# EAGLE design robot (EAGLE 7.0.0)
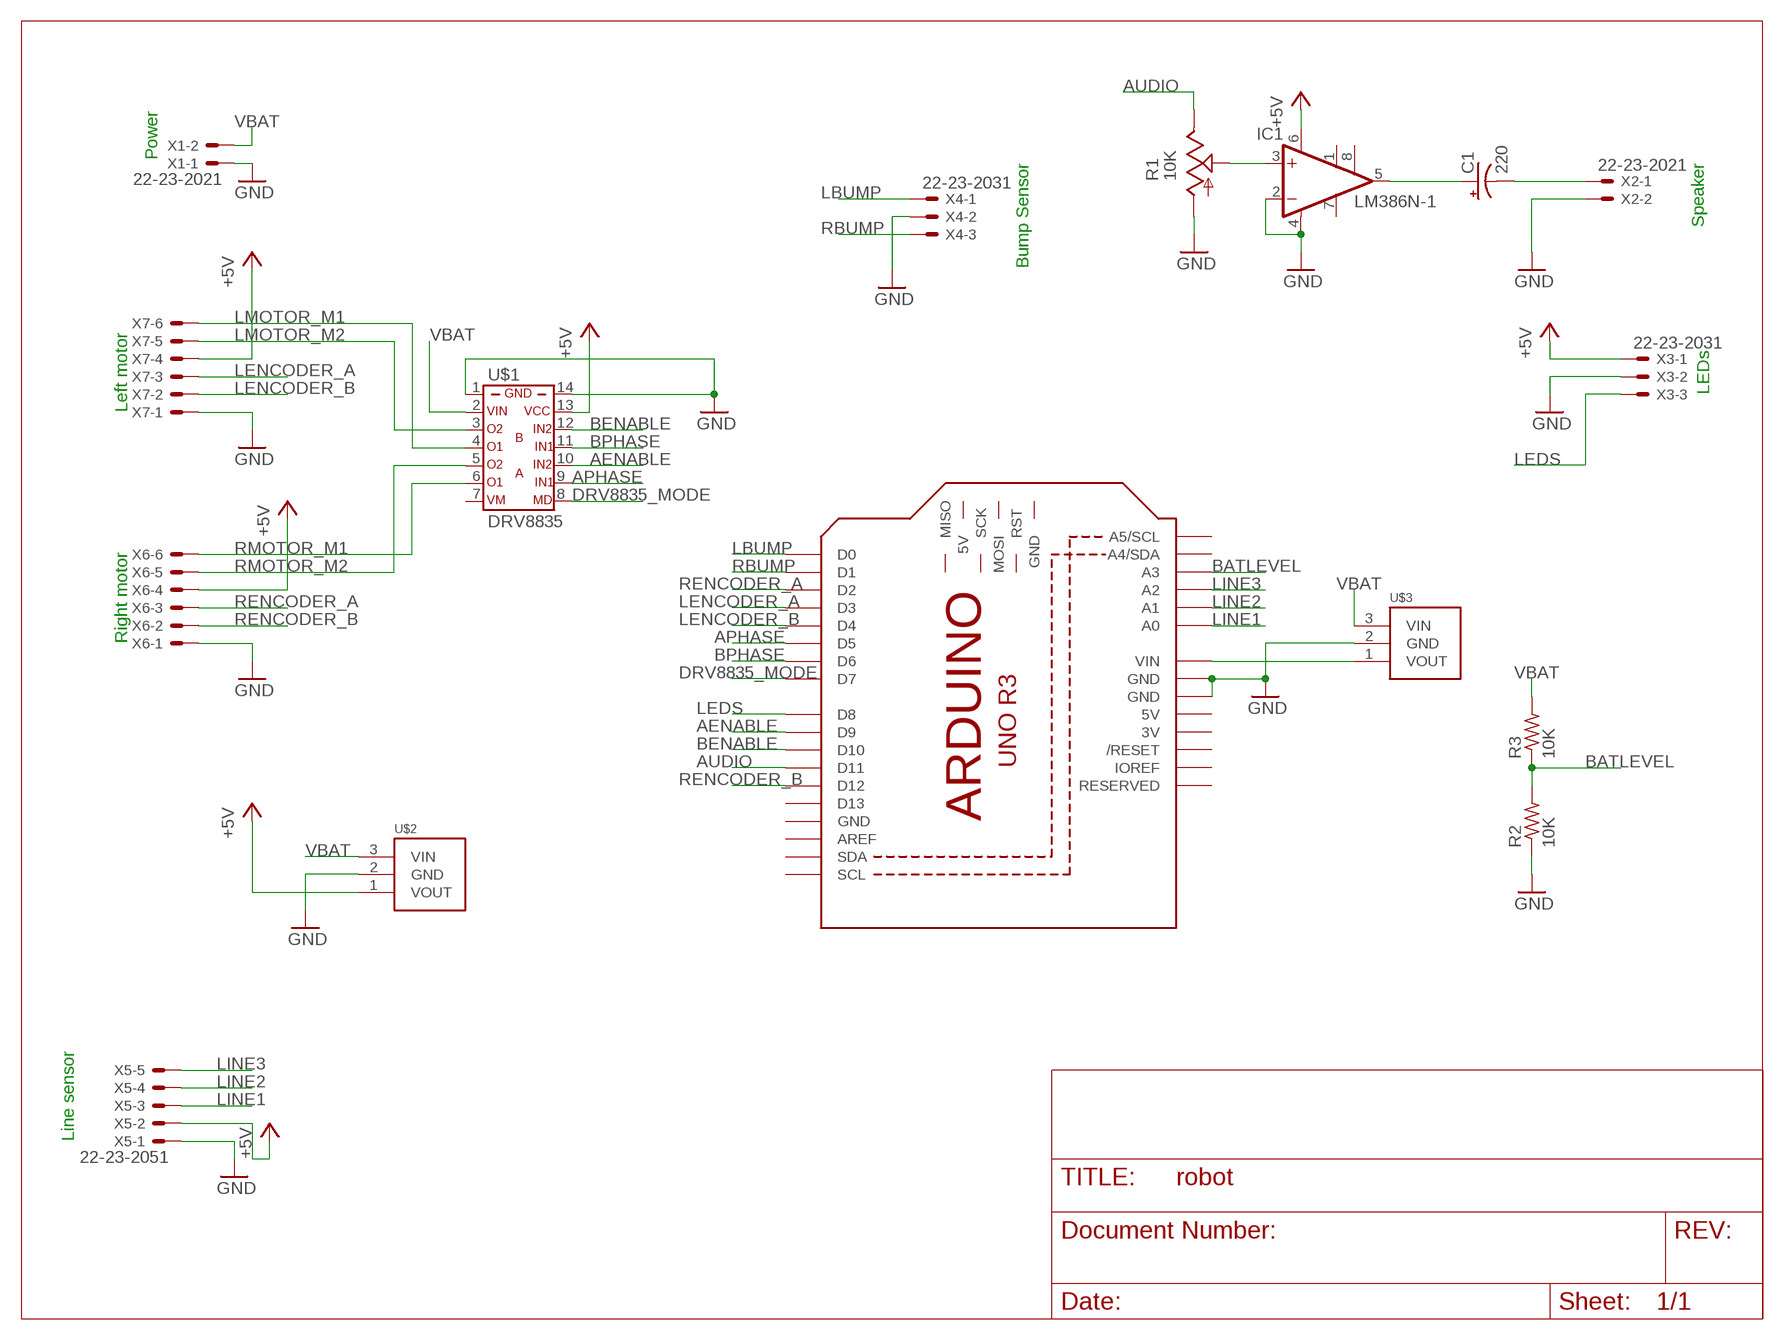
[diagram p0: schematic, sheet 1]

## Parts
C1  220  CPOL-USE2.5-7  [E2,5-7]
IC1  LM386N-1  [DIL08]
M2  ARDUINO_R3_ICSP  [ARDUINOR3_ICSP]
R1  10K  TRIM_US-S64W  [S64W]
R2  10K  R-US_V234/12  [V234/12]
R3  10K  R-US_V234/12  [V234/12]
U$1  DRV8835  [DIL14]
U$2  S7V7F5  [POLOLU-REG]
U$3  U3V12F9  [POLOLU-REG]
X1  22-23-2021  [22-23-2021]
X2  22-23-2021  [22-23-2021]
X3  22-23-2031  [22-23-2031]
X4  22-23-2031  [22-23-2031]
X5  22-23-2051  [22-23-2051]
X6  22-23-2061  [22-23-2061]
X7  22-23-2061  [22-23-2061]

## Nets
+5V [VCC]: IC1.6(VS) U$1.13 U$2.1(VOUT) X3.1 X5.2 X6.4 X7.4
AENABLE: M2.D9 U$1.10
APHASE: M2.D5 U$1.9
AUDIO: M2.D11 R1.E
BATLEVEL: M2.A3 R2.2 R3.1
BENABLE: M2.D10 U$1.12
BPHASE: M2.D6 U$1.11
DRV8835_MODE: M2.D7 U$1.8
GND [GND]: IC1.2(-IN) IC1.4(GND) M2.GND@1(GND) M2.GND@3(GND) R1.A R2.1 U$1.1 U$1.14 U$2.2(GND) U$3.2(GND) X1.1 X2.2 X3.2 X4.2 X5.1 X6.1 X7.1
LBUMP: M2.D0 X4.1
LEDS: M2.D8 X3.3
LENCODER_A: M2.D3 X7.3
LENCODER_B: M2.D4 X7.2
LINE1: M2.A0 X5.3
LINE2: M2.A1 X5.4
LINE3: M2.A2 X5.5
LMOTOR_M1 [MOTOR]: U$1.4 X7.6
LMOTOR_M2 [MOTOR]: U$1.3 X7.5
N$5 [VCC]: M2.VIN U$3.1(VOUT)
N$6: C1.+ IC1.5(OUT)
N$7: IC1.3(+IN) R1.S
N$8: C1.- X2.1
RBUMP: M2.D1 X4.3
RENCODER_A: M2.D2 X6.3
RENCODER_B: M2.D12 X6.2
RMOTOR_M1 [MOTOR]: U$1.6 X6.6
RMOTOR_M2 [MOTOR]: U$1.5 X6.5
VBAT [VBAT]: R3.2 U$1.2 U$2.3(VIN) U$3.3(VIN) X1.2
Unconnected: IC1.1(GAIN) IC1.7(BYPASS) IC1.8(GAIN) M2.5V_ICSP(5V) M2.A4(A4/SDA) M2.A5(A5/SCL) M2.AREF M2.D13 M2.GND@2(GND) M2.IOREF M2.MISO M2.MOSI M2.RESERVED M2.RESET(/RESET) M2.RESET_ICSP(RST) M2.SCK M2.SCL M2.SDA U$1.7

## Notes on the sheet
- Power | Bump Sensor | Speaker
- LEDs
- Left motor
- Right motor
- Line sensor

## Power pins joined to a net without a drawn wire
3V: M2.3V
5V: M2.5V
GND: M2.GND

## Library data of the parts
C1 = adafruit:CPOL-US: POLARIZED CAPACITOR, American symbol
IC1 = linear:LM386?-*: Low Voltage Audio Power Amplifier Source: http://cache.national.com/ds/LM/LM386.pdf
M2 = adafruit:ARDUINO_R3_ICSP
R1 = pot:TRIM_US-: POTENTIOMETER
R2 R3 = adafruit:R-US_: RESISTOR, American symbol
U$1 = robot:DRV8835: Pololu DRV8835 Dual Motor Driver Carrier
U$2 = robot:S7V7F5: Pololu Regulator
U$3 = robot:U3V12F9: Pololu 9V Step-Up Voltage Regulator U3V12F9
X1 X2 = con-molex:22-23-2021: .100" (2.54mm) Center Header - 2 Pin; MF: MOLEX; MPN: 22-23-2021; OC_FARNELL: 1462926; OC_NEWARK: 25C3832
X3 X4 = con-molex:22-23-2031: .100" (2.54mm) Center Header - 3 Pin; MF: MOLEX; MPN: 22-23-2031; OC_FARNELL: 1462950; OC_NEWARK: 30C0862
X5 = con-molex:22-23-2051: .100" (2.54mm) Center Header - 5 Pin; MF: MOLEX; MPN: 22-23-2051; OC_FARNELL: 1462952; OC_NEWARK: 38C9178
X6 X7 = con-molex:22-23-2061: .100" (2.54mm) Center Header - 6 Pin; MF: MOLEX; MPN: 22-23-2061; OC_FARNELL: 1462922; OC_NEWARK: 27C1933

## Net classes
0 default: width 0.203 mm
1 VCC: width 0.305 mm, drill 0.406 mm
2 VBAT: width 0.305 mm, drill 0.406 mm
3 GND: width 0.254 mm, drill 0.406 mm
4 MOTOR: width 0.305 mm, drill 0.406 mm

## Board
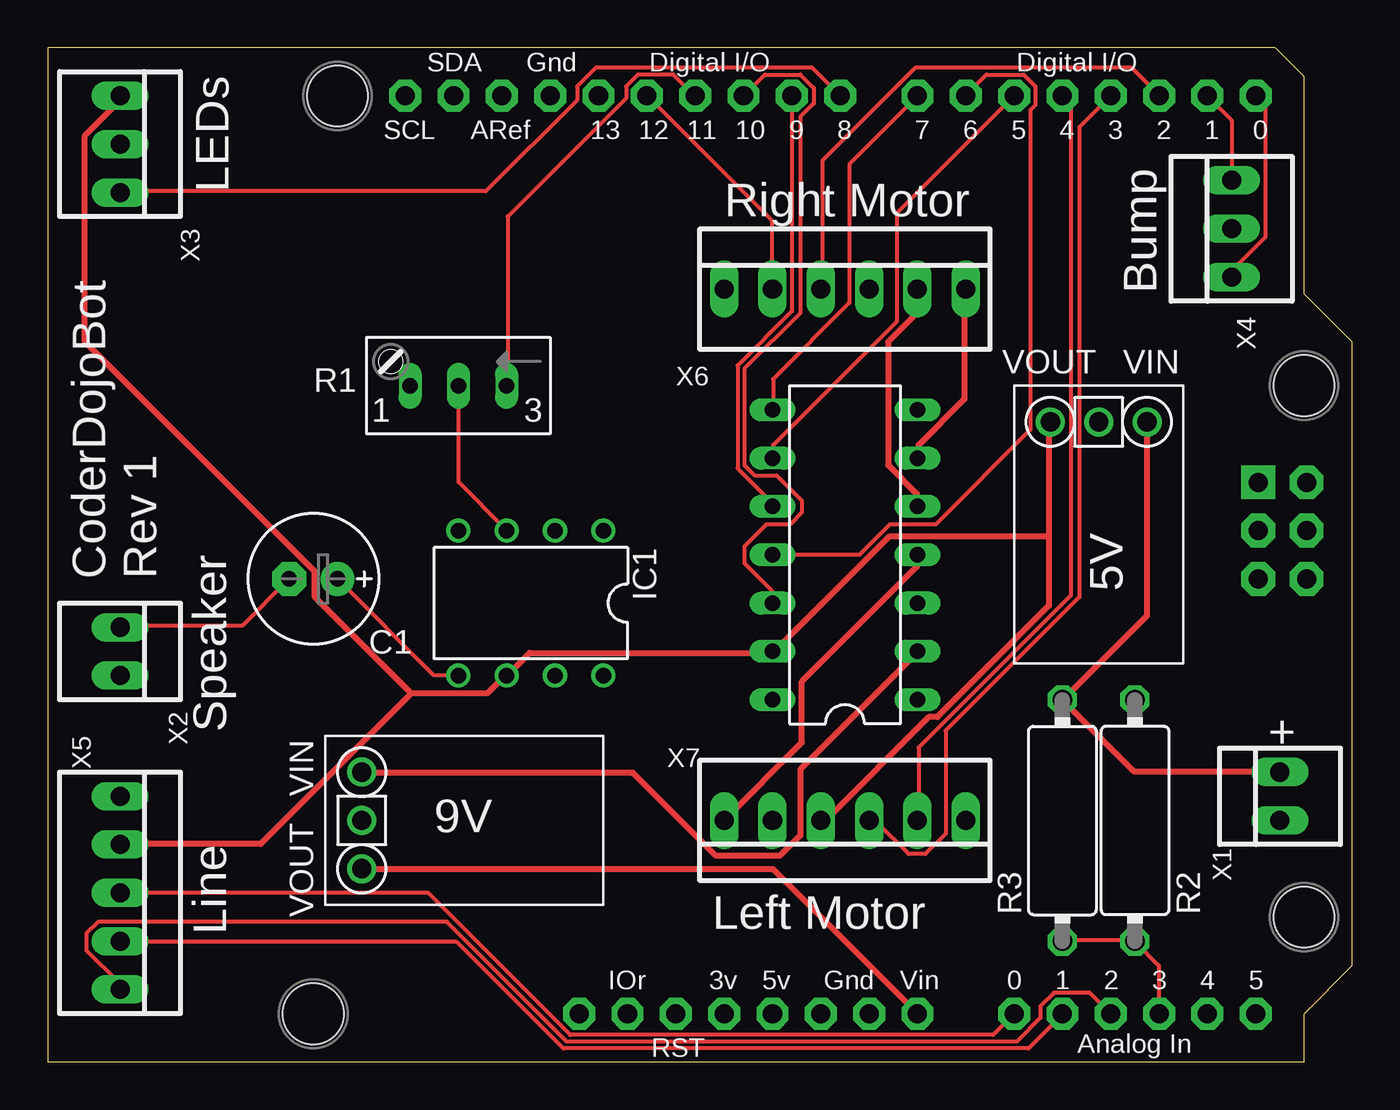
[diagram p1: board, top side]
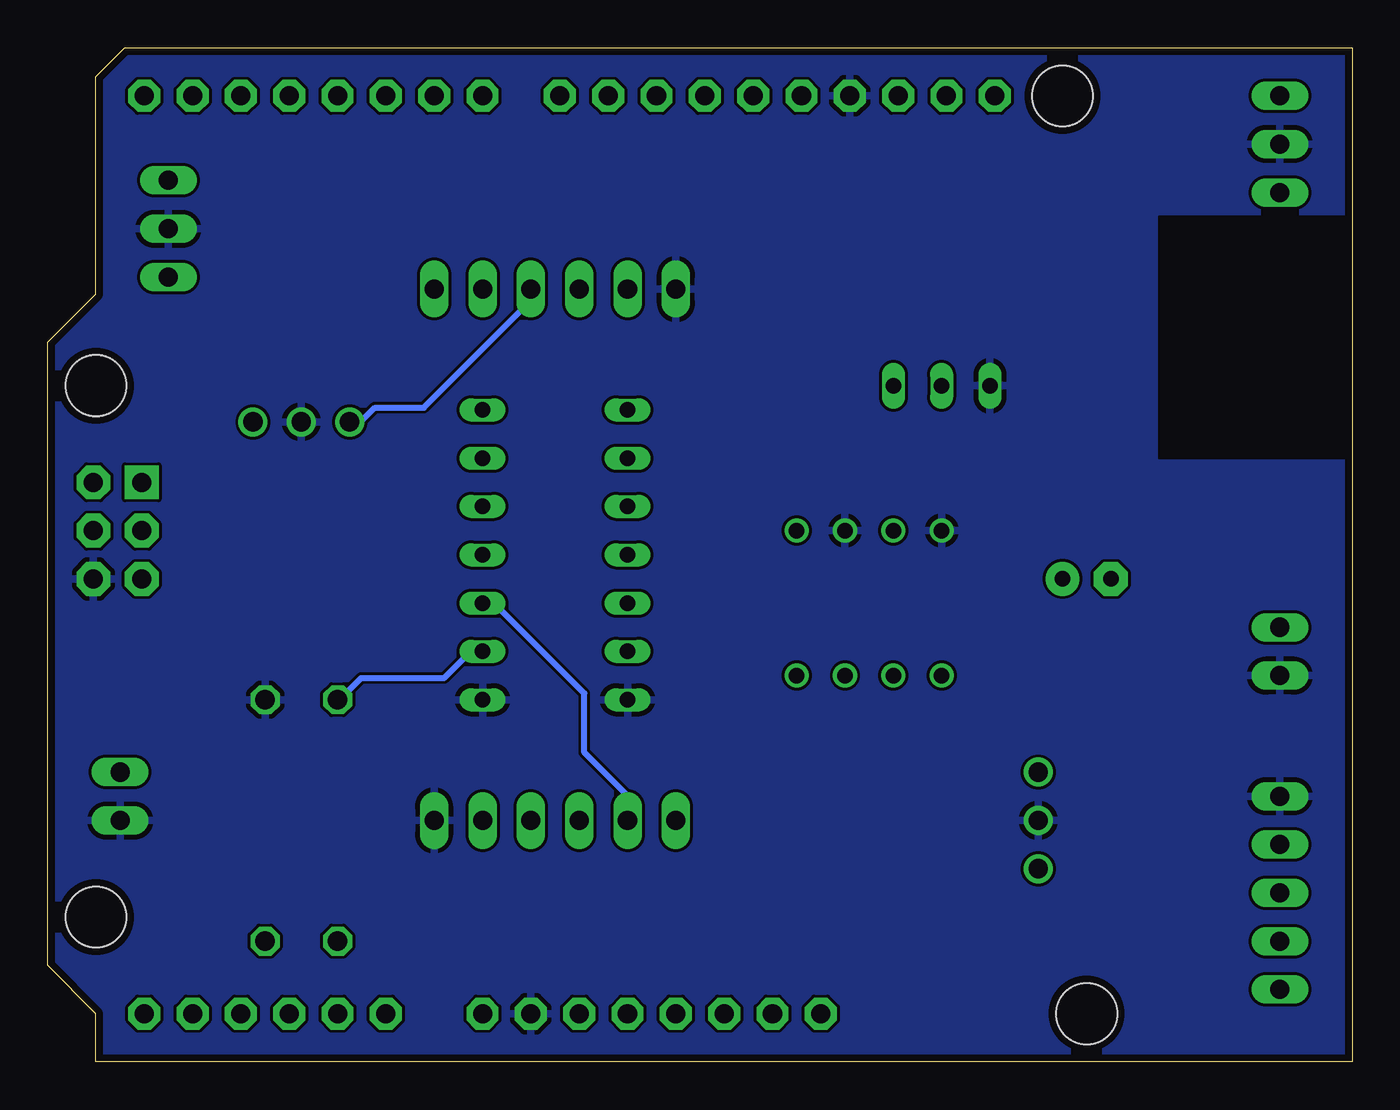
[diagram p2: board, bottom side, seen from below]

Size 68.58 x 53.34 mm. Coordinates in mm from the lower left corner, seen from the top.
Copper layers (1*16): Top 0.0356mm / dielectric 1.5011mm / Bottom 0.0356mm
Design rules "LaenPCBOrder": minimum track width 6mil, minimum drill 13mil, track to track 6mil, track to pad 6mil, pad to pad 6mil, via to via 6mil, smd to smd 6mil, copper to edge 15mil, drill to drill 6mil, minimum pad ring 7mil, minimum via ring 7mil, stop-mask expansion 3mil, vias tented up to drill 0mil, thermal gap 10mil
Holes 3.2 mm at 13.97,2.54 15.24,50.8 66.04,35.56 66.04,7.62

### Footprints (pad centres in the part's own frame; a part is rotated, then mirrored left to right if it is on the bottom)
E2,5-7 = drill 0.813 pad 1.778: + -1.27,0 | drill 0.813 pad 1.778 octagon: - 1.27,0
DIL08 = drill 0.813 pad 1.27: 1 -3.81,-3.81; 2 -1.27,-3.81; 3 1.27,-3.81; 4 3.81,-3.81; 5 3.81,3.81; 6 1.27,3.81; 7 -1.27,3.81; 8 -3.81,3.81
ARDUINOR3_ICSP = drill 1 pad 1.676 octagon: 3V 35.56,2.54; 5V 38.1,2.54; A0 50.8,2.54; A1 53.34,2.54; A2 55.88,2.54; A3 58.42,2.54; A4 60.96,2.54; A5 63.5,2.54; AREF 23.876,50.8; D0 63.5,50.8; D1 60.96,50.8; D2 58.42,50.8; D3 55.88,50.8; D4 53.34,50.8; D5 50.8,50.8; D6 48.26,50.8; D7 45.72,50.8; D8 41.656,50.8; D9 39.116,50.8; D10 36.576,50.8; D11 34.036,50.8; D12 31.496,50.8; D13 28.956,50.8; GND 26.416,50.8; GND@1 43.18,2.54; GND@2 40.64,2.54; IOREF 30.48,2.54; RESERVED 27.94,2.54; RESET 33.02,2.54; SCL 18.796,50.8; SDA 21.336,50.8; VIN 45.72,2.54 | drill 1 pad 1.778 octagon: 5V_ICSP 66.167,30.48; GND@3 66.167,25.4; MOSI 66.167,27.94; RESET_ICSP 63.627,25.4; SCK 63.627,27.94 | drill 1 pad 1.778 square: MISO 63.627,30.48
S64W = drill 0.813 long: A 2.54,1.27; E -2.54,1.27; S 0,1.27
V234/12 = drill 1.016 octagon: 1 -6.35,0; 2 6.35,0
DIL14 = drill 0.813 long: 1 -7.62,-3.81; 2 -5.08,-3.81; 3 -2.54,-3.81; 4 0,-3.81; 5 2.54,-3.81; 6 5.08,-3.81; 7 7.62,-3.81; 8 7.62,3.81; 9 5.08,3.81; 10 2.54,3.81; 11 0,3.81; 12 -2.54,3.81; 13 -5.08,3.81; 14 -7.62,3.81
POLOLU-REG = drill 1.016: 1 -2.54,0; 2 0,0; 3 2.54,0
22-23-2021 = drill 1 long: 1 -1.27,0; 2 1.27,0
22-23-2031 = drill 1 long: 1 -2.54,0; 2 0,0; 3 2.54,0
22-23-2051 = drill 1 long: 1 -5.08,0; 2 -2.54,0; 3 0,0; 4 2.54,0; 5 5.08,0
22-23-2061 = drill 1 long: 1 -6.35,0; 2 -3.81,0; 3 -1.27,0; 4 1.27,0; 5 3.81,0; 6 6.35,0

### Placement (x,y rotation side)
C1  13.97,25.4 180 top
IC1  25.4,24.13 180 top
M2  0,0 0 top
R1  21.59,36.83 180 top
R2  57.15,12.7 270 top
R3  53.34,12.7 90 top
U$1  41.91,26.67 90 top
U$2  55.24,33.66 0 top
U$3  16.51,12.7 90 top
X1  64.77,13.97 90 top
X2  3.81,21.59 270 top
X3  3.81,48.26 270 top
X4  62.23,43.81 90 top
X5  3.81,8.89 270 top
X6  41.91,40.64 0 top
X7  41.91,12.7 180 top

### Tracks (layer width: path | path; a pad name or v marks a point on that pad's centre or on a via)
+5V
  Top 0.305: 52.63,27.65 52.63,33.6 U$2.1 | 52.63,27.65 52.63,24 46.76,18.14 46.32,18.14 40.89,12.71 40.72,12.71 X7.4 | 19.11,19.38 11.2,11.47 3.82,11.47 X5.2 | 19.11,19.38 23.11,19.38 24,20.27 IC1.6 24.18,20.36 25.34,21.51 38.05,21.51 U$1.13 38.23,21.6 44.27,27.65 52.63,27.65 | 19.11,19.38 14.05,24.45 14.05,25.78 1.96,37.87 1.96,48.72 3.73,50.49 3.73,50.76 X3.1
  Bottom 0.305: X6.4 43.2,40.63 43.2,40.01 48.81,34.4 51.38,34.4 52.09,33.69 52.63,33.69 U$2.1
AENABLE
  Top 0.203: M2.D9 39.12,39.47 36.27,36.63 36.27,31.2 38.05,29.43 38.05,29.25 U$1.10
APHASE
  Top 0.203: M2.D5 44.63,44.63 44.63,38.94 38.14,32.45 38.14,31.83 U$1.9
AUDIO
  Top 0.203: R1.E 24.18,35.56 24.18,44.45 30.4,50.67 30.4,51.3 31.03,51.92 32.89,51.92 33.96,50.85 M2.D11
BATLEVEL
  Top 0.203: R3.1 53.34,6.4 57.07,6.4 R2.2 57.16,6.31 58.41,5.07 58.41,2.58 M2.A3
BENABLE
  Top 0.203: M2.D10 37.69,51.92 39.56,51.92 40.27,51.21 40.27,50.41 39.56,49.7 39.56,39.38 36.63,36.45 36.63,31.38 37.16,30.85 38.32,30.85 39.65,29.52 39.65,28.89 39.03,28.27 37.78,28.27 36.63,27.11 36.63,26.23 38.05,24.8 38.05,24.18 U$1.12
BPHASE
  Top 0.203: U$1.11 42.67,26.67 44.27,28.27 46.67,28.27 51.65,33.25 51.65,50.05 51.92,50.32 51.92,51.3 51.3,51.92 49.34,51.92 48.27,50.85 M2.D6
DRV8835_MODE
  Top 0.203: U$1.8 38.14,34.31 38.14,35.92 42.14,39.92 42.14,47.21 45.7,50.76 M2.D7
GND
  pour Bottom: 0,53.34 64.77,53.34 66.04,52.07 66.04,40.64 68.58,38.1 68.58,5.08 66.04,2.54 66.04,0 0,0
LBUMP
  Top 0.203: X4.1 62.23,41.6 64.01,43.38 64.01,50.32 63.56,50.76 M2.D0
LEDS
  Top 0.203: M2.D8 40.18,52.27 28.8,52.27 27.83,51.3 27.83,50.58 23.02,45.78 3.82,45.78 X3.3
LENCODER_A
  Top 0.203: X7.3 43.2,12.62 43.56,12.62 45.25,10.94 46.14,10.94 47.21,12 47.21,17.42 54.23,24.45 54.23,49.16 55.83,50.76 M2.D3
LENCODER_B
  Top 0.203: X7.2 45.78,12.71 45.78,16.54 53.78,24.54 53.78,50.32 53.34,50.76 M2.D4
LINE1
  Top 0.203: X5.3 20,8.89 27.47,1.42 49.7,1.42 50.76,2.49 M2.A0
LINE2
  Top 0.203: X5.4 3.82,6.31 21.51,6.31 27.11,0.71 51.56,0.71 53.34,2.49 M2.A1
LINE3
  Top 0.203: X5.5 3.73,3.82 3.73,4.18 2.04,5.87 2.04,6.76 2.67,7.38 20.98,7.38 27.29,1.07 50.94,1.07 52.18,2.31 52.18,2.93 52.9,3.65 54.76,3.65 55.83,2.58 M2.A2
LMOTOR_M1
  Top 0.305: U$1.4 45.7,26.67 45.7,26.05 39.65,20 39.65,16.8 35.56,12.71 X7.6
LMOTOR_M2
  Bottom 0.305: U$1.3 45.7,24.09 45.07,24.09 40.36,19.38 40.36,16.27 38.14,14.05 38.14,12.71 X7.5
N$5
  Top 0.305: U$3.1 16.54,10.13 38.14,10.13 45.7,2.58 M2.VIN
N$6
  Top 0.203: IC1.5 21.51,20.36 20.27,20.36 15.29,25.34 C1.+
N$7
  Top 0.203: R1.S 21.6,35.56 21.6,30.49 24.09,28 IC1.3
N$8
  Top 0.203: X2.1 3.82,22.94 10.22,22.94 12.62,25.34 C1.-
RBUMP
  Top 0.203: X4.3 62.23,49.52 60.98,50.76 M2.D1
RENCODER_A
  Top 0.203: X6.3 40.72,40.72 40.72,47.38 45.61,52.27 56.98,52.27 58.41,50.85 M2.D2
RENCODER_B
  Top 0.203: X6.2 38.05,40.72 38.05,44.27 31.56,50.76 M2.D12
RMOTOR_M1
  Top 0.305: U$1.6 45.78,31.83 45.78,32.45 48.18,34.85 48.18,40.63 X6.6
RMOTOR_M2
  Top 0.305: U$1.5 45.7,29.25 45.7,29.87 44.18,31.38 44.18,37.87 45.7,39.38 45.7,40.63 X6.5
VBAT
  Top 0.305: X1.2 64.72,15.29 57.07,15.29 53.34,19.02 R3.2 53.43,19.11 57.78,23.47 U$2.3 | U$3.3 16.54,15.2 30.76,15.2 35.12,10.85 38.49,10.85 39.56,11.91 39.56,15.38 45.7,21.51 U$1.2
  Bottom 0.305: U$1.2 45.78,21.51 46.41,21.51 47.74,20.18 52.09,20.18 53.16,19.11 53.34,19.11 R3.2

### Text on the board
tPlace: Bump | LEDs | Right Motor | Speaker | CoderDojoBot / Rev 1 | 5V | + | 9V | Line | Left Motor